# Altium schematic sheet Sheet1.SchDoc
size A
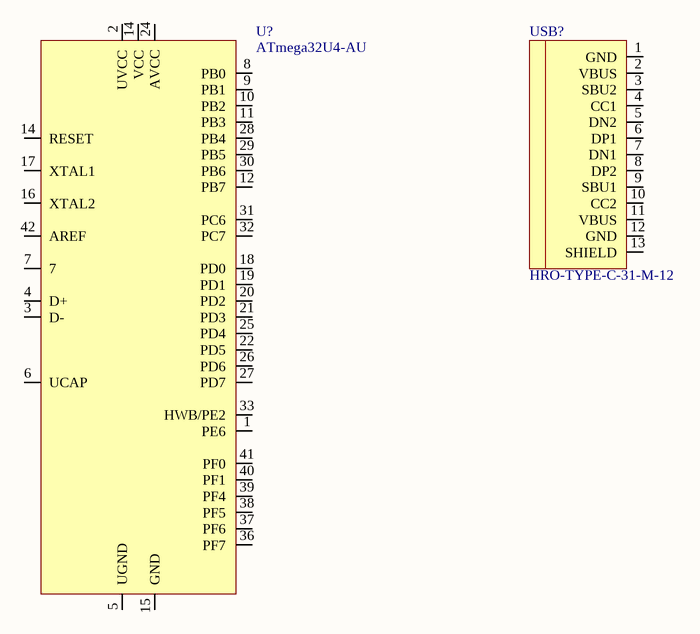
[diagram p0: Sheet1.SchDoc]

## Parts
U?  ATmega32U4-AU
USB?  HRO-TYPE-C-31-M-12

## Nets

Not connected (* = marked no-connect by the designer): U? 1(PE6) 2(UVCC) 3(D-) 4(D+) 5(UGND) 6(UCAP) 7 8(PB0) 9(PB1) 10(PB2) 11(PB3) 12(PB7) 14(RESET) 15(GND) 16(XTAL2) 17(XTAL1) 18(PD0) 19(PD1) 20(PD2) 21(PD3) 22(PD5) 24(AVCC) 25(PD4) 26(PD6) 27(PD7) 28(PB4) 29(PB5) 30(PB6) 31(PC6) 32(PC7) 33(HWB/PE2) 36(PF7) 37(PF6) 38(PF5) 39(PF4) 40(PF1) 41(PF0) 42(AREF); USB? 1(GND) 2(VBUS) 3(SBU2) 4(CC1) 5(DN2) 6(DP1) 7(DN1) 8(DP2) 9(SBU1) 10(CC2) 11(VBUS) 12(GND) 13(SHIELD)